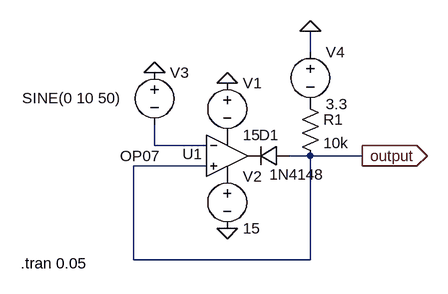
[diagram p0: schematic (11)Clipper using opamp.asc]
(11)Clipper using opamp.asc, the LTspice schematic file:
Version 4
SHEET 1 880 680
WIRE 240 0 240 -32
WIRE 0 144 0 112
WIRE 80 144 0 144
WIRE 240 160 208 160
WIRE 320 160 240 160
WIRE 80 176 -32 176
WIRE -32 320 -32 176
WIRE 240 320 240 160
WIRE 240 320 -32 320
FLAG 112 48 0
FLAG 112 272 0
FLAG 0 32 0
FLAG 240 -32 0
FLAG 320 160 output
IOPIN 320 160 Out
SYMBOL OpAmps\\OP07 112 96 R0
WINDOW 0 -69 61 Left 2
WINDOW 3 -165 64 Left 2
SYMATTR InstName U1
SYMBOL voltage 112 32 R0
WINDOW 123 0 0 Left 0
WINDOW 39 0 0 Left 0
SYMATTR InstName V1
SYMATTR Value 15
SYMBOL voltage 112 176 R0
WINDOW 123 0 0 Left 0
WINDOW 39 0 0 Left 0
SYMATTR InstName V2
SYMATTR Value 15
SYMBOL voltage 0 16 R0
WINDOW 3 -204 55 Left 2
WINDOW 123 0 0 Left 0
WINDOW 39 0 0 Left 0
SYMATTR InstName V3
SYMATTR Value SINE(0 10 50)
SYMBOL diode 208 144 R90
WINDOW 0 0 32 VBottom 2
WINDOW 3 29 -11 VTop 2
SYMATTR InstName D1
SYMATTR Value 1N4148
SYMBOL res 224 64 R0
SYMATTR InstName R1
SYMATTR Value 10k
SYMBOL voltage 240 -16 R0
WINDOW 123 0 0 Left 0
WINDOW 39 0 0 Left 0
SYMATTR InstName V4
SYMATTR Value 3.3
TEXT -206 326 Left 2 !.tran 0.05

The netlist it stands for:
* (11)Clipper using opamp.asc
XU1 output N001 P001 P002 P003 LT1001  ; OP07, pins In+ In- V+ V- OUT
V1 0 P001 15
V2 P002 0 15
V3 0 N001 SINE(0 10 50)
D1 output P003 1N4148
R1 P004 output 10k
V4 0 P004 3.3
.model D D
.lib standard.dio
.tran 0.05
.lib LTC.lib
.backanno
.end